# Altium project Aidan_Macro_Pad.PrjPcb
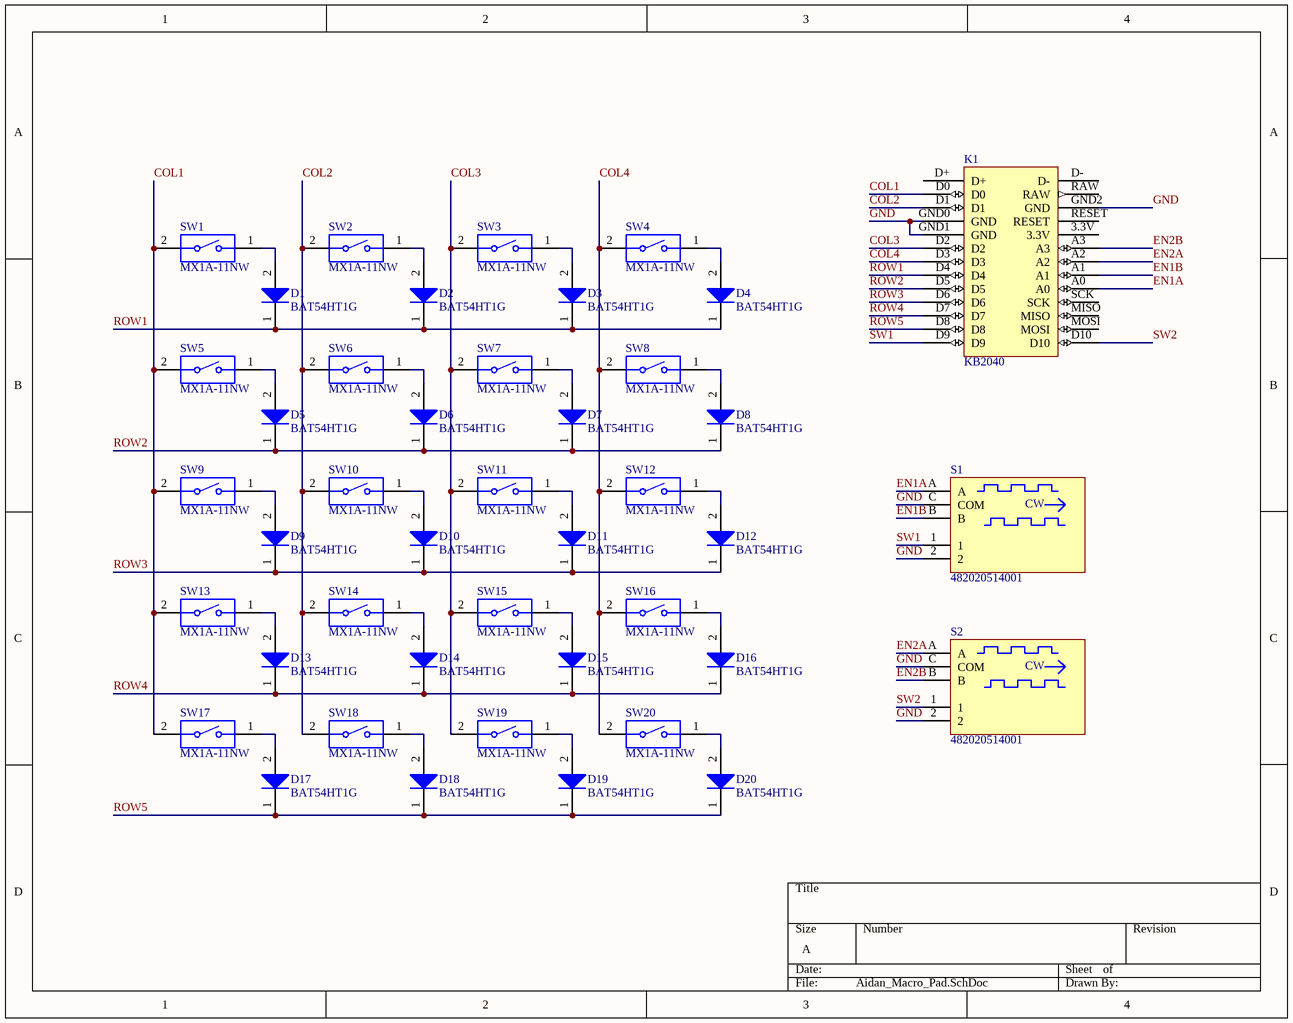
[diagram p0: Aidan_Macro_Pad.SchDoc]
1 sheet, 43 parts. Net scope: global (net labels, ports and power ports of the same name join across sheets).
Board file: Aidan_Macro_Pad.PcbDoc

## Sheet Aidan_Macro_Pad.SchDoc
size A; SheetNumber: 1; SheetTotal: 1

### Parts
D1  BAT54HT1G  [ONSC-SOD-323-2-477-02_V]
D2  BAT54HT1G  [ONSC-SOD-323-2-477-02_V]
D3  BAT54HT1G  [ONSC-SOD-323-2-477-02_V]
D4  BAT54HT1G  [ONSC-SOD-323-2-477-02_V]
D5  BAT54HT1G  [ONSC-SOD-323-2-477-02_V]
D6  BAT54HT1G  [ONSC-SOD-323-2-477-02_V]
D7  BAT54HT1G  [ONSC-SOD-323-2-477-02_V]
D8  BAT54HT1G  [ONSC-SOD-323-2-477-02_V]
D9  BAT54HT1G  [ONSC-SOD-323-2-477-02_V]
D10  BAT54HT1G  [ONSC-SOD-323-2-477-02_V]
D11  BAT54HT1G  [ONSC-SOD-323-2-477-02_V]
D12  BAT54HT1G  [ONSC-SOD-323-2-477-02_V]
D13  BAT54HT1G  [ONSC-SOD-323-2-477-02_V]
D14  BAT54HT1G  [ONSC-SOD-323-2-477-02_V]
D15  BAT54HT1G  [ONSC-SOD-323-2-477-02_V]
D16  BAT54HT1G  [ONSC-SOD-323-2-477-02_V]
D17  BAT54HT1G  [ONSC-SOD-323-2-477-02_V]
D18  BAT54HT1G  [ONSC-SOD-323-2-477-02_V]
D19  BAT54HT1G  [ONSC-SOD-323-2-477-02_V]
D20  BAT54HT1G  [ONSC-SOD-323-2-477-02_V]
K1  KB2040  [KB2040 Footprint]
S1  482020514001  [4820xx514001]
S2  482020514001  [4820xx514001]
SW1  MX1A-11NW  [CHRY-MX1A-11NW_V]
SW2  MX1A-11NW  [CHRY-MX1A-11NW_V]
SW3  MX1A-11NW  [CHRY-MX1A-11NW_V]
SW4  MX1A-11NW  [CHRY-MX1A-11NW_V]
SW5  MX1A-11NW  [CHRY-MX1A-11NW_V]
SW6  MX1A-11NW  [CHRY-MX1A-11NW_V]
SW7  MX1A-11NW  [CHRY-MX1A-11NW_V]
SW8  MX1A-11NW  [CHRY-MX1A-11NW_V]
SW9  MX1A-11NW  [CHRY-MX1A-11NW_V]
SW10  MX1A-11NW  [CHRY-MX1A-11NW_V]
SW11  MX1A-11NW  [CHRY-MX1A-11NW_V]
SW12  MX1A-11NW  [CHRY-MX1A-11NW_V]
SW13  MX1A-11NW  [CHRY-MX1A-11NW_V]
SW14  MX1A-11NW  [CHRY-MX1A-11NW_V]
SW15  MX1A-11NW  [CHRY-MX1A-11NW_V]
SW16  MX1A-11NW  [CHRY-MX1A-11NW_V]
SW17  MX1A-11NW  [CHRY-MX1A-11NW_V]
SW18  MX1A-11NW  [CHRY-MX1A-11NW_V]
SW19  MX1A-11NW  [CHRY-MX1A-11NW_V]
SW20  MX1A-11NW  [CHRY-MX1A-11NW_V]

### Nets
COL1: K1.D0 SW1.2 SW5.2 SW9.2 SW13.2 SW17.2
COL2: K1.D1 SW2.2 SW6.2 SW10.2 SW14.2 SW18.2
COL3: K1.D2 SW3.2 SW7.2 SW11.2 SW15.2 SW19.2
COL4: K1.D3 SW4.2 SW8.2 SW12.2 SW16.2 SW20.2
EN1A: K1.A0 S1.A
EN1B: K1.A1 S1.B
EN2A: K1.A2 S2.A
EN2B: K1.A3 S2.B
GND: K1.GND0(GND) K1.GND1(GND) K1.GND2(GND) S1.2 S1.C(COM) S2.2 S2.C(COM)
ROW1: D1.1(K) D2.1(K) D3.1(K) D4.1(K) K1.D4
ROW2: D5.1(K) D6.1(K) D7.1(K) D8.1(K) K1.D5
ROW3: D9.1(K) D10.1(K) D11.1(K) D12.1(K) K1.D6
ROW4: D13.1(K) D14.1(K) D15.1(K) D16.1(K) K1.D7
ROW5: D17.1(K) D18.1(K) D19.1(K) D20.1(K) K1.D8
SW1: K1.D9 S1.1
SW2: K1.D10 S2.1
NetD1_2: D1.2(A) SW1.1
NetD2_2: D2.2(A) SW2.1
NetD3_2: D3.2(A) SW3.1
NetD4_2: D4.2(A) SW4.1
NetD5_2: D5.2(A) SW5.1
NetD6_2: D6.2(A) SW6.1
NetD7_2: D7.2(A) SW7.1
NetD8_2: D8.2(A) SW8.1
NetD9_2: D9.2(A) SW9.1
NetD10_2: D10.2(A) SW10.1
NetD11_2: D11.2(A) SW11.1
NetD12_2: D12.2(A) SW12.1
NetD13_2: D13.2(A) SW13.1
NetD14_2: D14.2(A) SW14.1
NetD15_2: D15.2(A) SW15.1
NetD16_2: D16.2(A) SW16.1
NetD17_2: D17.2(A) SW17.1
NetD18_2: D18.2(A) SW18.1
NetD19_2: D19.2(A) SW19.1
NetD20_2: D20.2(A) SW20.1

Not connected (* = marked no-connect by the designer): K1 3.3V D+ D- MISO MOSI RAW RESET SCK

### Notes on the sheet
- (in symbol CMP-00030-00001-2) CW

### Library data of the parts
D1-D20 = CMP-004-00031-1: Rectifier Diode, 1 Phase, 1 Element, 0.2A, 30V V(RRM), Silicon; Non-rep Pk Forward Current-Max: 600mA; Reverse Recovery Time-Max: 0.005us; Qualification Status: Not Qualified; Max Power Dissipation: 200mW; Forward Voltage: 240mV; Max Output current: 200mA; Package Body Material: Plastic; Number of Elements: 1; Terminal Finish: Tin; Diode Element Material: SILICON; JESD-609 Code: e3; Reach SVHC Compliant: Yes; Package Shape: Rectangular; Moisture Sensitivity Level: 1; Diode Type: RECTIFIER; JESD-30 Code: R-PDSO-G2; Terminal Form: Gull Wing; RoHS Compliant: Yes; Max Operating Temperature: 150°C; Package Style: SMALL OUTLINEMeter; Surface Mount: Yes; Rep Pk Reverse Voltage-Max: 30V; Min Operating Temperature: -55°C; Pins: 2; Terminal Position: DUAL
K1 = CMP-00024-00006-3: Keyboard driver
S1 S2 = CMP-00030-00001-2: Rotary Position Encoder; RoHS Compliant: Yes
SW1-SW20 = CMP-011-00013-1: Keypad Switch, 1 Switches, SPST, Momentary, 0.01A, 12VDC, 0.78N, Solder Terminal, Through Hole-straight; Manufacturer Series: MX; Contact DC Max Rating R Load: .01A@12VDC; Number of Switches: 1; Body Breadth: 15.6mm; Contact Current(DC)-Max: 10mA; Contact Bounce Time-Max: 5ms; Contact Voltage(DC)-Max: 12V; Body Height: 11.6mm; Circuit Configuration: 1X1; Switch Action: MOMENTARY; Min Operating Temperature: -10°C; Max Operating Temperature: 70°C; Termination: Solder; Switch Type: Keypad; Operating Force-Max: 0.78N; Body Length or Diameter: 15.6mm; RoHS Compliant: Yes; Reach SVHC Compliant: Yes; Switch Function: SPST; Mounting Technology: Through Hole